# Altium project Voltage Ind. 1.0.PrjPcb
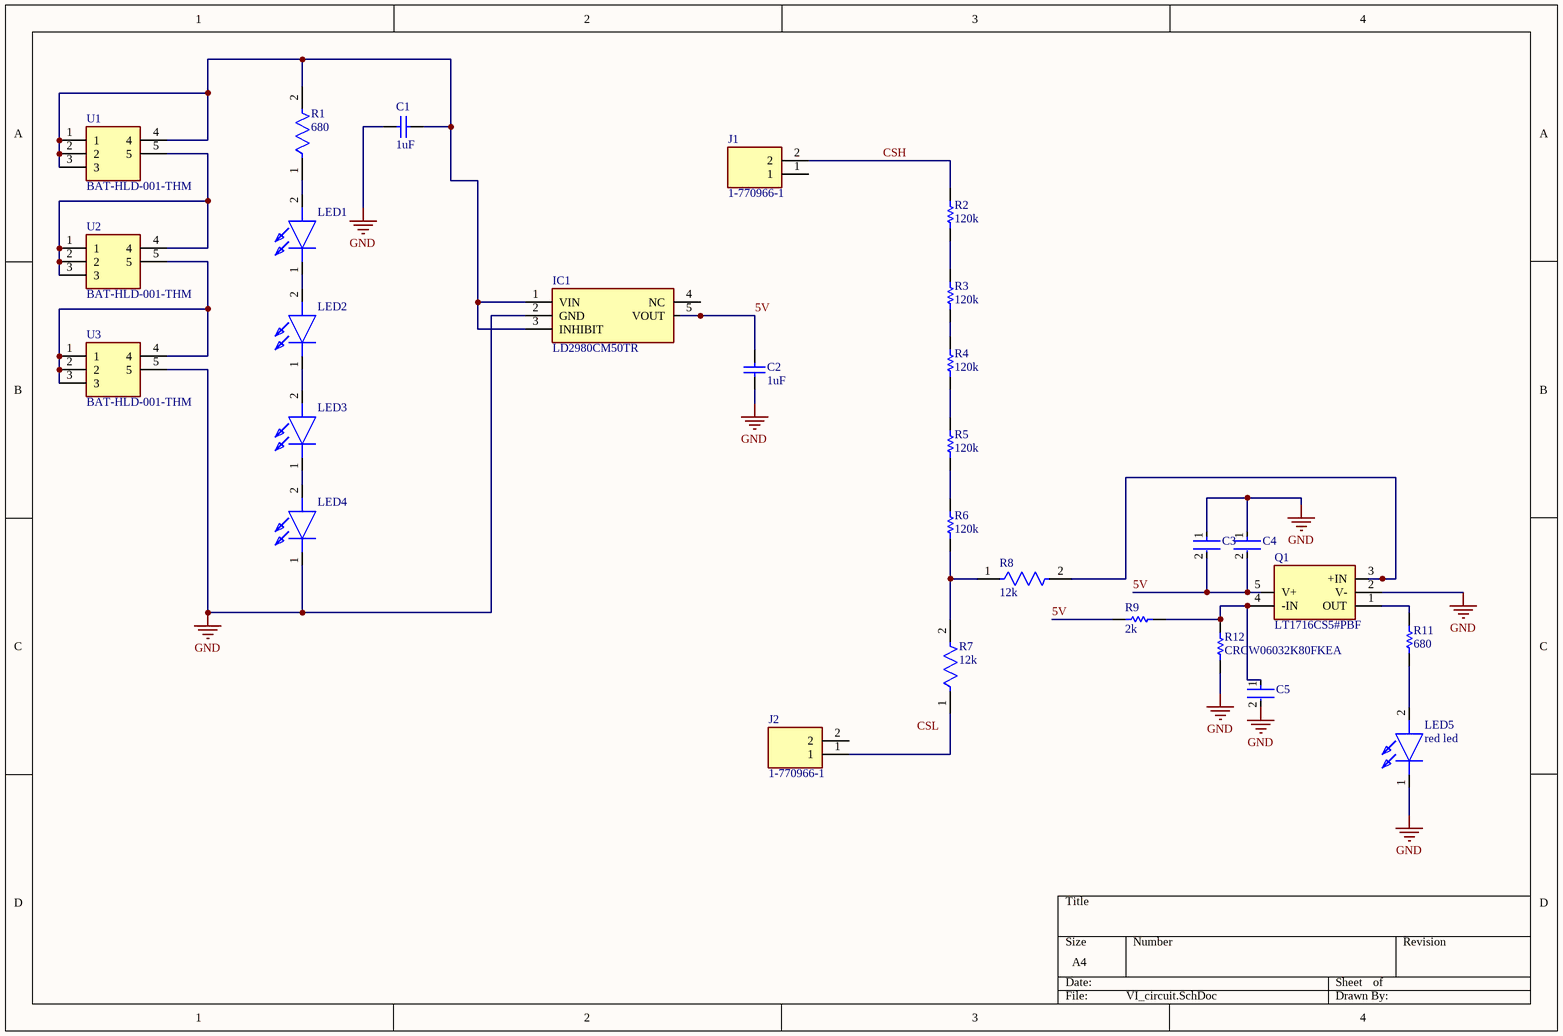
[diagram p0: VI_circuit.SchDoc]
1 sheet, 28 parts. Net scope: global (net labels, ports and power ports of the same name join across sheets).
Board file: PCB2.PcbDoc

## Sheet VI_circuit.SchDoc
size A4; SheetNumber: 1; SheetTotal: 1; SPICEModelCacheRQZYFVQB: <root> / <DocumentId>RQZYFVQB</DocumentId> / <CacheFrame Number="0"> / <Model Name="umk107bj105_a-t" Kind="CKT"> / <Text>* UMK107BJ105_A-T     SPICE MODEL  ( General Type ) / *-------------------------------------------------------------------------------------------------------- / * Model Generated by TAIYO YUDEN Corporation (http://www.ty-top.com) / * Version 1.0 / * TAIYO YUDEN Control No. 170508_130520 / * Copyright(c) 2012 TAIYO YUDEN CO.,LTD. All Rights Reserved. / *-------------------------------------------------------------------------------------------------------- / * / * Products Name : Multilayer Ceramic Capacitors / * / * Characteristics : / *     Capacitance : 1 uF , Rated Voltage : 50V , TCC : X5R / *     Case Size : 1.6 x 0.8 / 0.063 x 0.031 [mm/inch] , Thickness : 0.8 / 0.031 [mm/inch] / *     (Conditions: Temperature = 25 degC , DC Bias Current/Voltage = 0A / 0V) / * / * Frequency Range : 40Hz - 3GHz / * / * External Node Assignments : / * / *  1  o---| |---o  2 / * / *-------------------------------------------------------------------------------------------------------- / .SubCkt UMK107BJ105_A-T 1 2 / **************************** / C0 1 110 0.79929u / Cm 1 101 0.13681u / C1 101 102 0.26224u / Rc1 101 102 5.8806k / C2 102 103 0.057839u / Rc2 102 103 469.42 / C3 103 110 0.014568u / Rc3 103 110 14.853 / C2m 1 301 0.13283u / C21 301 302 1.2593u / Rc21 301 302 6.3079k / C22 302 303 1.1189u / Rc22 302 303 6.9405k / C23 303 304 1.1421u / Rc23 303 304 6.4848k / C24 304 305 0.36861u / Rc24 304 305 785 / C25 305 306 0.39327u / Rc25 305 306 637.41 / C26 306 307 0.27451u / Rc26 306 307 19.365 / C27 307 308 0.15295u / Rc27 307 308 23.239 / C28 308 309 0.17569u / Rc28 308 309 17.788 / C29 309 110 1420.6p / Rc29 309 110 1.9725 / Rp0 1 110 500Meg / L0 110 120 0.24088n / Lm 120 130 0.1369n / L1 120 121 0.1842n / RL1 121 130 0.29804 / L2 120 122 0.40657n / RL2 122 130 0.57395 / L3 120 123 0.85773n / RL3 123 130 0.82282 / CR 120 124 0.11463u / LR 124 125 0.25983n / RR 125 130 52.447m / CL 130 140 1.4637p / LL 130 140 0.23986n / RL 130 140 33.985 / Rs 140 2 6.8539m / **************************** / .ends UMK107BJ105_A-T</Text> / </Model> / </CacheFrame> / </root>

### Parts
C1  1uF  [CAPC1608X90X35LL15T15]
C2  1uF  [CAPC1608X90X35LL15T15]
C3  (no value)  [FP-CGA3E-0_3-0_1-IPC_A]
C4  (no value)  [FP-0603-L_1_6_0_1-W_0_8_0-IPC_A]
C5  (no value)  [FP-0603-L_1_6_0_1-W_0_8_0-IPC_A]
IC1  LD2980CM50TR  [SOT95P280X145-5N]
J1  1-770966-1  [17709661]
J2  1-770966-1  [17709661]
LED1  (no value)  [C503B-BCN]
LED2  (no value)  [C503B-BCN]
LED3  (no value)  [C503B-BCN]
LED4  (no value)  [C503B-BCN]
LED5  red led  [C503B-BCN]
Q1  LT1716CS5#PBF  [SOT95P280X100-5N]
R1  680  [FP-CRCW0603-e3-MFG]
R2  120k  [RESC1609X50X30NL10T20]
R3  120k  [RESC1609X50X30NL10T20]
R4  120k  [RESC1609X50X30NL10T20]
R5  120k  [RESC1609X50X30NL10T20]
R6  120k  [RESC1609X50X30NL10T20]
R7  12k  [FP-CRCW0603-e3-IPC_A]
R8  12k  [FP-CRCW0603-e3-IPC_A]
R9  2k  [RESC1608X55X30ML15T15]
R11  680  [RESC1608X55X30ML15T15]
R12  CRCW06032K80FKEA  [RESC1609X50X30NL10T20]
U1  BAT-HLD-001-THM  [BATHLD001THM]
U2  BAT-HLD-001-THM  [BATHLD001THM]
U3  BAT-HLD-001-THM  [BATHLD001THM]

### Nets
GND: C1.1 C2.1 C3.1 C4.1 C5.2 IC1.2(GND) LED4.1(K) LED5.1(K) Q1.2(V-) R12.1 U3.5
5V: C2.2 C3.2 C4.2 IC1.5(VOUT) Q1.5(V+) R9.1
CSH: J1.2 R2.2
NetC1_2: C1.2 IC1.1(VIN) IC1.3(INHIBIT) R1.2 U1.1 U1.2 U1.3 U1.4
NetC5_1: C5.1 Q1.4(-IN) R9.2 R12.2
NetJ2_1: J2.1 R7.1
NetLED1_1: LED1.1(K) LED2.2(A)
NetLED1_2: LED1.2(A) R1.1
NetLED2_1: LED2.1(K) LED3.2(A)
NetLED3_1: LED3.1(K) LED4.2(A)
NetLED5_2: LED5.2(A) R11.1
NetQ1_1: Q1.1(OUT) R11.2
NetQ1_3: Q1.3(+IN) R8.2
NetR2_1: R2.1 R3.2
NetR3_1: R3.1 R4.2
NetR4_1: R4.1 R5.2
NetR5_1: R5.1 R6.2
NetR6_1: R6.1 R7.2 R8.1
NetU1_5: U1.5 U2.1 U2.2 U2.3 U2.4
NetU2_5: U2.5 U3.1 U3.2 U3.3 U3.4

Not connected (* = marked no-connect by the designer): IC1 4(NC); J1 1; J2 2

### Notes on the sheet
- Labels drawn without touching a wire or pin: CSL

### Library data of the parts
C1 C2 = CMP-2006-02298-2: Manufacturer: Kemet; Part Number: C0603C105K4RACTU
C3 = CMP-2000-07546-2: Cap Ceramic 100nF 50V X7R 10% Pad SMD 0603 +125°C Automotive T/R; Weight: 7.1E-05oz; Composition: Ceramic; Max Operating Temperature: 125°C; Termination: SMD/SMT; Dielectric: X7R; Length: 1.6mm; Package Quantity: 1; REACH SVHC: No SVHC; Lead Free: Lead Free; Case Code (Metric): 1608; Min Operating Temperature: -55°C; Packaging: Tape and Reel; Tolerance: 10%; Voltage Rating: 50V; Case Code (Imperial): 0603; Capacitance: 100nF; Case/Package: 0603; Voltage Rating (DC): 50V; Depth: 0.8mm; Radiation Hardening: No; Ratings: AEC-Q200; Mount: Surface Mount; Voltage: 50V; Thickness: 0.035inch; Width: 0.8mm; Height: 0.8mm
C4 C5 = CMP-2000-05447-3: None; Tolerance: 10%; Voltage Rating: 50V; Capacitance: 1uF; Dielectric: X5R; Height: 0.8mm; Depth: 0.8mm; Number of Pins: 2; Length: 1.6mm; Thickness: 0.035inch; Contact Plating: Nickel; Radiation Hardening: No; Package Quantity: 1; Case/Package: 0603; Halogen Free: Halogen Free; RoHS Compliant: Yes; Termination: SMD/SMT; Max Operating Temperature: 85°C; Min Operating Temperature: -55°C; Case Code (Metric): 1608; Construction: Flat; Voltage Rating (DC): 50V; Packaging: Tape and Reel; Series: M; Case Code (Imperial): 0603; Width: 0.031inch; Mount: Surface Mount
IC1 = LD2980CM50TR: Integrated Circuit; Manufacturer_Name: STMicroelectronics; Datasheet Link: http://www.st.com/st-web-ui/static/active/en/resource/technical/document/datasheet/CD00001636.pdf; Height: 1.45mm; Manufacturer_Part_Number: LD2980CM50TR; Mouser Part Number: 511-LD2980CM50; Mouser Price/Stock: https://www.mouser.co.uk/ProductDetail/STMicroelectronics/LD2980CM50TR?qs=fUp1KqWiDeH%252BLPcpxdfyeg%3D%3D; Arrow Part Number: LD2980CM50TR; Arrow Price/Stock: https://www.arrow.com/en/products/ld2980cm50tr/stmicroelectronics?region=nac
J1 J2 = 1-770966-1: Connector; Manufacturer_Name: TE Connectivity; Datasheet Link: https://www.te.com/commerce/DocumentDelivery/DDEController?Action=showdoc&DocId=Customer+Drawing%7F770966%7FG1%7Fpdf%7FEnglish%7FENG_CD_770966_G1.pdf%7F1-770966-1; Height: 7.77mm; Manufacturer_Part_Number: 1-770966-1; Mouser Part Number: 571-1-770966-1; Mouser Price/Stock: https://www.mouser.co.uk/ProductDetail/TE-Connectivity-AMP/1-770966-1?qs=zthB9rB9njD9XGaVaokK%2Fw%3D%3D; Arrow Part Number: 1-770966-1; Arrow Price/Stock: https://www.arrow.com/en/products/1-770966-1/te-connectivity?region=europe
LED1-LED5 = C503B-GAS-CB0F0792: LED; Manufacturer_Name: Wolfspeed; Datasheet Link: https://www.cree.com/led-components/media/documents/1300-C503B-BAS-BAN-GAS-GAN.pdf; Manufacturer_Part_Number: C503B-GAS-CB0F0792; Mouser Part Number: 941-C503BGASCB0F0792; Mouser Price/Stock: https://www.mouser.com/Search/Refine.aspx?Keyword=941-C503BGASCB0F0792; Arrow Part Number: C503B-GAS-CB0F0792; Arrow Price/Stock: https://www.arrow.com/en/products/c503b-gas-cb0f0792/cree
Q1 = LT1716CS5#PBF: Transistor; Manufacturer_Name: Analog Devices; Datasheet Link: https://g.componentsearchengine.com/Datasheets/2/LT1716CS5#PBF.pdf; Height: 1mm; Manufacturer_Part_Number: LT1716CS5#PBF; Mouser Part Number: 584-LT1716CS5#PBF; Mouser Price/Stock: https://www.mouser.com/Search/Refine.aspx?Keyword=584-LT1716CS5%23PBF
R1 = CMP-2000-03529-2: RES Thick Film, 680Ω, 1%, 0.1W, 100ppm/°C, 0603; Voltage Rating (DC): 75V; Max Power Dissipation: 100mW; Resistance: 680R; Radiation Hardening: No; Case Code (Imperial): 0603; Number of Pins: 2; Termination: SMD/SMT; Lead Free: Lead Free; Contact Plating: Tin; Case Code (Metric): 1608; Max Operating Temperature: 155°C; Tolerance: 1%; Military Standard: Not; Features: Automotive AEC-Q200; Power Rating: 100mW; Width: 0.85mm; Depth: 0.85mm; Height: 0.45mm; Case/Package: 0603; Min Operating Temperature: -55°C; Length: 1.55mm; Voltage Rating: 75V; Composition: Thick Film; Working Voltage: 75V; Temperature Coefficient: 100ppm/°C; Packaging: Tape and Reel; Package Quantity: 10; Weight: 7.1E-05oz; Number of Terminations: 2
R2-R6 = CMP-2000-03868-1: Manufacturer: Vishay Dale; Part Number: CRCW0603120KFKEA
R7 R8 = CMP-2000-03877-2: RES Thick Film, 12kΩ, 1%, 0.1W, 100ppm/°C, 0603; Resistance: 12kR; Voltage Rating: 75V; Power Rating: 100mW; Termination: SMD/SMT; Case Code (Metric): 1608; Max Operating Temperature: 155°C; Depth: 0.85mm; Width: 0.033inch; Military Standard: Not; Composition: Thick Film; Features: Automotive AEC-Q200; Lead Free: Lead Free; Weight: 7.1E-05oz; Mount: Surface Mount; Height: 0.45mm; Min Operating Temperature: -55°C; Tolerance: 1%; Case/Package: 0603; Temperature Coefficient: 100ppm/°C; Contact Plating: Tin; Voltage Rating (DC): 75V; Length: 1.55mm; Packaging: Tape and Reel; Case Code (Imperial): 0603; Max Power Dissipation: 100mW; Package Quantity: 10; Radiation Hardening: No; Number of Terminations: 2
R9 R11 = CMP-2000-00317-1: Part Number: ERJ-3EKF2001V; Manufacturer: Panasonic
R12 = CMP-2000-03186-1: Manufacturer: Vishay Dale; Part Number: CRCW06032K80FKEA
U1-U3 = BAT-HLD-001-THM: Undefined or Miscellaneous; Manufacturer_Name: Linx Technologies; Height: 4.2mm; Manufacturer_Part_Number: BAT-HLD-001-THM